# Altium schematic sheet USB_SWITCH_A.SchDoc
size A; SheetNumber: 9; SheetTotal: 12
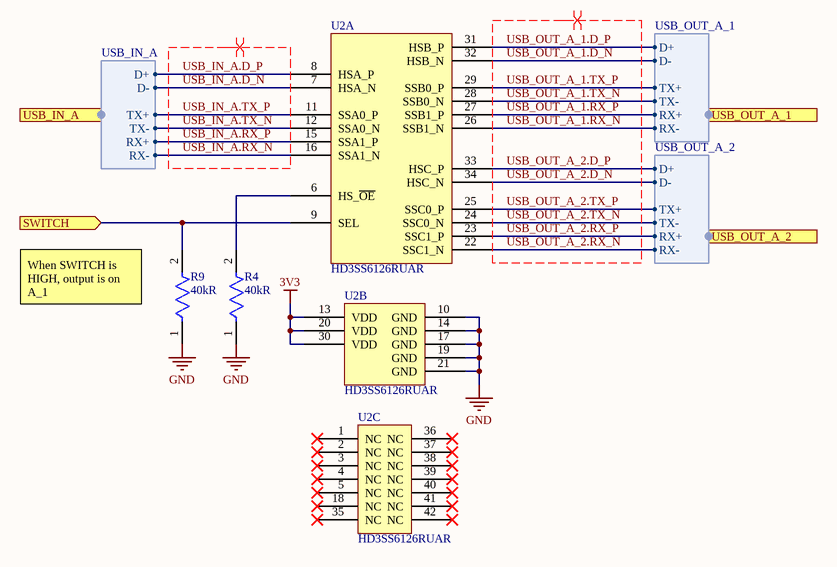
[diagram p0: USB_SWITCH_A.SchDoc]

## Parts
R4  Resistance: 40kR  [FP-CRCW0805-e3-MFG]  (hidden comment: CRCW080540K0FKEA)
R9  Resistance: 40kR  [FP-CRCW0805-e3-MFG]  (hidden comment: CRCW080540K0FKEA)
U2  HD3SS6126RUAR  [QFN50P900X350X80-43N]  (parts A,B,C of 3)

## Ports
SWITCH (in, see USB[2B], HDMI[2B], HDMI_SWITCH[1C], SWITCH[4B], USB[2C], USB_SWITCH_B[1B]), USB_IN_A (harness USB_IN_A, see USB[2B], USB_IN[3B]), USB_OUT_A_1 (harness USB_OUT_A_1, see USB[3B], USB_OUT_A[3B]), USB_OUT_A_2 (harness USB_OUT_A_2, see USB[3B], USB_OUT_A[3B])

## Harnesses
USB_OUT_A_1: TX+, TX-, RX+, RX-, D+, D-
USB_IN_A: TX+, TX-, RX+, RX-, D+, D-
USB_OUT_A_2: TX+, TX-, RX+, RX-, D+, D-

## Nets
3V3: U2.13(VDD) U2.20(VDD) U2.30(VDD)
GND: R4.1 R9.1 U2.10(GND) U2.14(GND) U2.17(GND) U2.19(GND) U2.21(GND)
SWITCH: R9.2 U2.9(SEL) ; port SWITCH
USB_IN_A.D_N: U2.7(HSA_N) ; port USB_IN_A.D-
USB_IN_A.D_P: U2.8(HSA_P) ; port USB_IN_A.D+
USB_IN_A.RX_N: U2.16(SSA1_N) ; port USB_IN_A.RX-
USB_IN_A.RX_P: U2.15(SSA1_P) ; port USB_IN_A.RX+
USB_IN_A.TX_N: U2.12(SSA0_N) ; port USB_IN_A.TX-
USB_IN_A.TX_P: U2.11(SSA0_P) ; port USB_IN_A.TX+
USB_OUT_A_1.D_N: U2.32(HSB_N) ; port USB_OUT_A_1.D-
USB_OUT_A_1.D_P: U2.31(HSB_P) ; port USB_OUT_A_1.D+
USB_OUT_A_1.RX_N: U2.26(SSB1_N) ; port USB_OUT_A_1.RX-
USB_OUT_A_1.RX_P: U2.27(SSB1_P) ; port USB_OUT_A_1.RX+
USB_OUT_A_1.TX_N: U2.28(SSB0_N) ; port USB_OUT_A_1.TX-
USB_OUT_A_1.TX_P: U2.29(SSB0_P) ; port USB_OUT_A_1.TX+
USB_OUT_A_2.D_N: U2.34(HSC_N) ; port USB_OUT_A_2.D-
USB_OUT_A_2.D_P: U2.33(HSC_P) ; port USB_OUT_A_2.D+
USB_OUT_A_2.RX_N: U2.22(SSC1_N) ; port USB_OUT_A_2.RX-
USB_OUT_A_2.RX_P: U2.23(SSC1_P) ; port USB_OUT_A_2.RX+
USB_OUT_A_2.TX_N: U2.24(SSC0_N) ; port USB_OUT_A_2.TX-
USB_OUT_A_2.TX_P: U2.25(SSC0_P) ; port USB_OUT_A_2.TX+
NetR4_2: R4.2 U2.6(HS_~{OE})

Not connected (* = marked no-connect by the designer): U2 1(NC)* 2(NC)* 3(NC)* 4(NC)* 5(NC)* 18(NC)* 35(NC)* 36(NC)* 37(NC)* 38(NC)* 39(NC)* 40(NC)* 41(NC)* 42(NC)*

## Layout directives
differential pair: USB_IN_A.D_N, USB_IN_A.D_P, USB_IN_A.RX_N, USB_IN_A.RX_P, USB_IN_A.TX_N, USB_IN_A.TX_P, USB_OUT_A_1.D_N, USB_OUT_A_1.D_P, USB_OUT_A_1.RX_N, USB_OUT_A_1.RX_P, USB_OUT_A_1.TX_N, USB_OUT_A_1.TX_P, USB_OUT_A_2.D_N, USB_OUT_A_2.D_P, USB_OUT_A_2.RX_N, USB_OUT_A_2.RX_P, USB_OUT_A_2.TX_N, USB_OUT_A_2.TX_P

## Notes on the sheet
- (near R9) When SWITCH is HIGH, output is on A_1

## Library data of the parts
R4 R9 = CMP-02407-003498-1: RES Thick Film, 40kΩ, 1%, 0.125W, 100ppm/°C, 0805; Max Power Dissipation: 125mW; Tolerance: 1%; Features: Automotive AEC-Q200; Max Operating Temperature: 155°C; Composition: Thick Film; Length: 0.079inch; Case/Package: 0805; Min Operating Temperature: -55°C; Packaging: Tape and Reel; Number of Terminations: 2; Width: 0.049inch; Height: 0.02inch; Package Quantity: 5000; Lead Free: Lead Free; Temperature Coefficient: 100ppm/°C
U2 = HD3SS6126RUAR: High Speed Differential Switch 2: 1/1: 2 MUX/DEMUX USB 2.0/USB 3.0 3.3V T/R 42-Pin WQFN EP